# Altium schematic sheet DI 24v DC.SchDoc
size A4
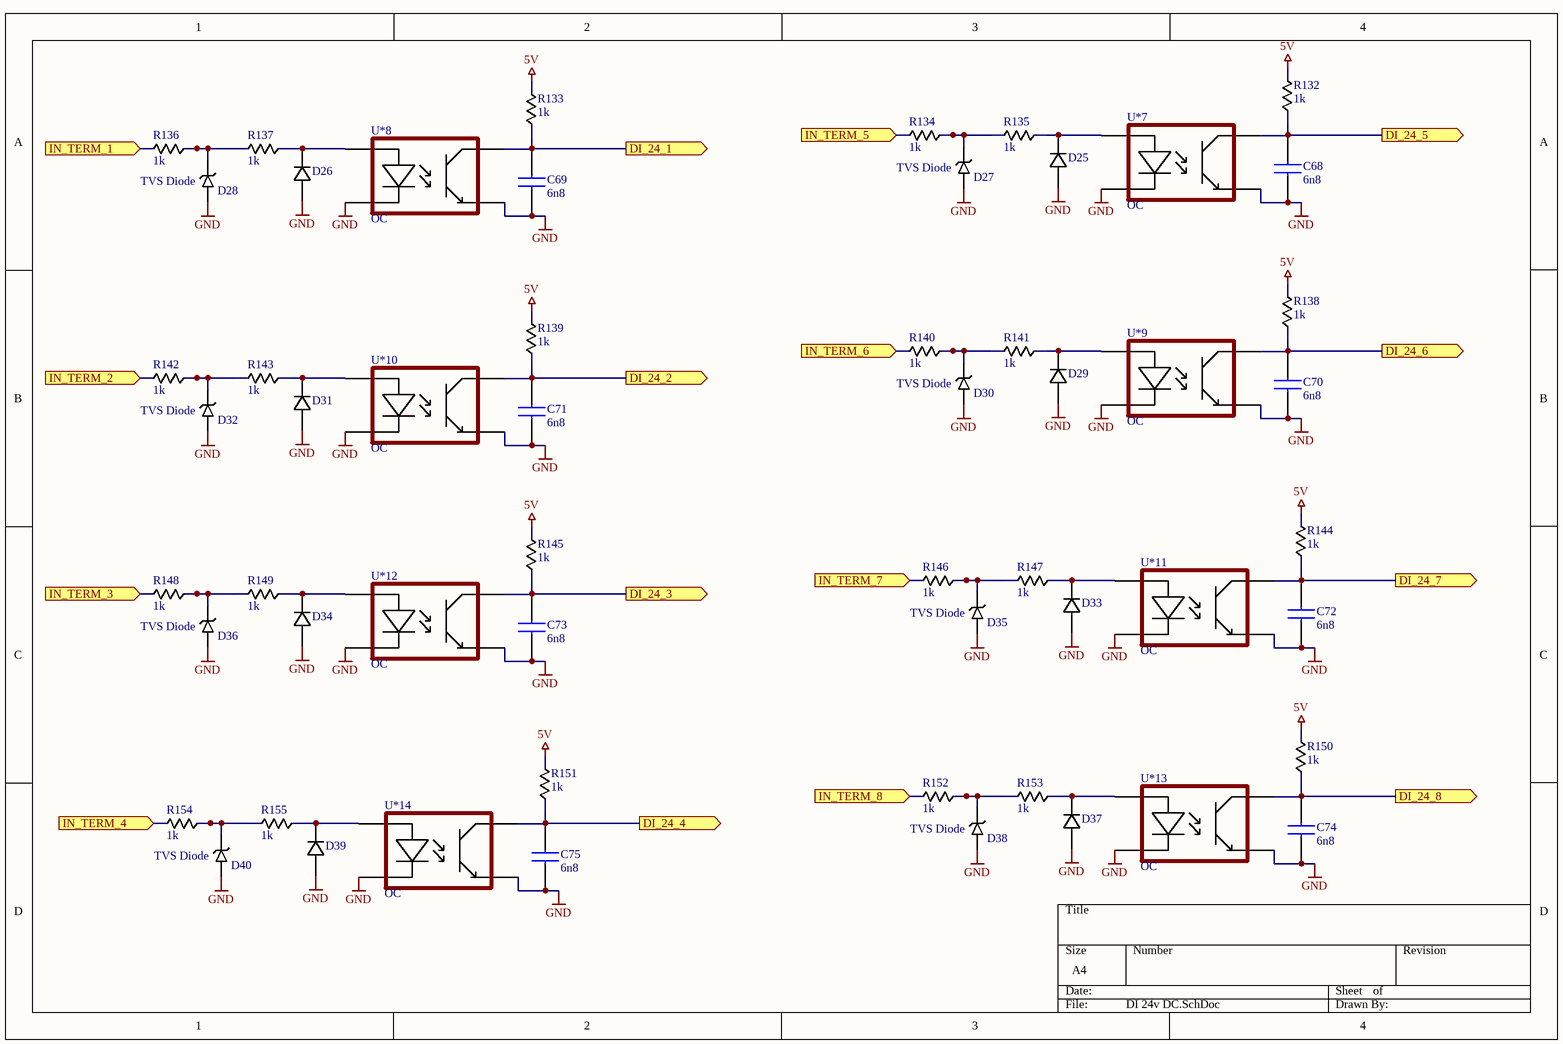
[diagram p0: DI 24v DC.SchDoc]

## Parts
C68  6n8  [0603 CAP]
C69  6n8  [0603 CAP]
C70  6n8  [0603 CAP]
C71  6n8  [0603 CAP]
C72  6n8  [0603 CAP]
C73  6n8  [0603 CAP]
C74  6n8  [0603 CAP]
C75  6n8  [0603 CAP]
D25  Diode_1  [SOD-323 (SC-76) - Reflow]  (value not drawn)
D26  Diode_1  [SOD-323 (SC-76) - Reflow]  (value not drawn)
D27  TVS Diode  [DO-214AC / SMA - POL]
D28  TVS Diode  [DO-214AC / SMA - POL]
D29  Diode_1  [SOD-323 (SC-76) - Reflow]  (value not drawn)
D30  TVS Diode  [DO-214AC / SMA - POL]
D31  Diode_1  [SOD-323 (SC-76) - Reflow]  (value not drawn)
D32  TVS Diode  [DO-214AC / SMA - POL]
D33  Diode_1  [SOD-323 (SC-76) - Reflow]  (value not drawn)
D34  Diode_1  [SOD-323 (SC-76) - Reflow]  (value not drawn)
D35  TVS Diode  [DO-214AC / SMA - POL]
D36  TVS Diode  [DO-214AC / SMA - POL]
D37  Diode_1  [SOD-323 (SC-76) - Reflow]  (value not drawn)
D38  TVS Diode  [DO-214AC / SMA - POL]
D39  Diode_1  [SOD-323 (SC-76) - Reflow]  (value not drawn)
D40  TVS Diode  [DO-214AC / SMA - POL]
R132  1k  [0603 CAP]
R133  1k  [0603 CAP]
R134  1k  [0603 CAP]
R135  1k  [0603 CAP]
R136  1k  [0603 CAP]
R137  1k  [0603 CAP]
R138  1k  [0603 CAP]
R139  1k  [0603 CAP]
R140  1k  [0603 CAP]
R141  1k  [0603 CAP]
R142  1k  [0603 CAP]
R143  1k  [0603 CAP]
R144  1k  [0603 CAP]
R145  1k  [0603 CAP]
R146  1k  [0603 CAP]
R147  1k  [0603 CAP]
R148  1k  [0603 CAP]
R149  1k  [0603 CAP]
R150  1k  [0603 CAP]
R151  1k  [0603 CAP]
R152  1k  [0603 CAP]
R153  1k  [0603 CAP]
R154  1k  [0603 CAP]
R155  1k  [0603 CAP]
U*7  OC  [LTV-357T]
U*8  OC  [LTV-357T]
U*9  OC  [LTV-357T]
U*10  OC  [LTV-357T]
U*11  OC  [LTV-357T]
U*12  OC  [LTV-357T]
U*13  OC  [LTV-357T]
U*14  OC  [LTV-357T]

## Ports
DI_24_1, DI_24_2, DI_24_3, DI_24_4, DI_24_5, DI_24_6, DI_24_7, DI_24_8, IN_TERM_1, IN_TERM_2, IN_TERM_3, IN_TERM_4, IN_TERM_5, IN_TERM_6, IN_TERM_7, IN_TERM_8

## Nets
5V: R132.2 R133.2 R138.2 R139.2 R144.2 R145.2 R150.2 R151.2
GND: C68.1 C69.1 C70.1 C71.1 C72.1 C73.1 C74.1 C75.1 D25.2(A) D26.2(A) D27.1 D28.1 D29.2(A) D30.1 D31.2(A) D32.1 D33.2(A) D34.2(A) D35.1 D36.1 D37.2(A) D38.1 D39.2(A) D40.1 U*7.Cathode(C) U*7.Emmiter(E) U*8.Cathode(C) U*8.Emmiter(E) U*9.Cathode(C) U*9.Emmiter(E) U*10.Cathode(C) U*10.Emmiter(E) U*11.Cathode(C) U*11.Emmiter(E) U*12.Cathode(C) U*12.Emmiter(E) U*13.Cathode(C) U*13.Emmiter(E) U*14.Cathode(C) U*14.Emmiter(E)
DI_24_1: C69.2 R133.1 U*8.Collector(C) ; port DI_24_1
DI_24_2: C71.2 R139.1 U*10.Collector(C) ; port DI_24_2
DI_24_3: C73.2 R145.1 U*12.Collector(C) ; port DI_24_3
DI_24_4: C75.2 R151.1 U*14.Collector(C) ; port DI_24_4
DI_24_5: C68.2 R132.1 U*7.Collector(C) ; port DI_24_5
DI_24_6: C70.2 R138.1 U*9.Collector(C) ; port DI_24_6
DI_24_7: C72.2 R144.1 U*11.Collector(C) ; port DI_24_7
DI_24_8: C74.2 R150.1 U*13.Collector(C) ; port DI_24_8
IN_TERM_1: R136.2 ; port IN_TERM_1
IN_TERM_2: R142.2 ; port IN_TERM_2
IN_TERM_3: R148.2 ; port IN_TERM_3
IN_TERM_4: R154.2 ; port IN_TERM_4
IN_TERM_5: R134.2 ; port IN_TERM_5
IN_TERM_6: R140.2 ; port IN_TERM_6
IN_TERM_7: R146.2 ; port IN_TERM_7
IN_TERM_8: R152.2 ; port IN_TERM_8
NetD25_1: D25.1(C) R135.1 U*7.Anode(A)
NetD26_1: D26.1(C) R137.1 U*8.Anode(A)
NetD27_2: D27.2 R134.1 R135.2
NetD28_2: D28.2 R136.1 R137.2
NetD29_1: D29.1(C) R141.1 U*9.Anode(A)
NetD30_2: D30.2 R140.1 R141.2
NetD31_1: D31.1(C) R143.1 U*10.Anode(A)
NetD32_2: D32.2 R142.1 R143.2
NetD33_1: D33.1(C) R147.1 U*11.Anode(A)
NetD34_1: D34.1(C) R149.1 U*12.Anode(A)
NetD35_2: D35.2 R146.1 R147.2
NetD36_2: D36.2 R148.1 R149.2
NetD37_1: D37.1(C) R153.1 U*13.Anode(A)
NetD38_2: D38.2 R152.1 R153.2
NetD39_1: D39.1(C) R155.1 U*14.Anode(A)
NetD40_2: D40.2 R154.1 R155.2

## Library data of the parts
C68-C75 = 0603 CAP: GRM188R71H682MA01D; Manufacturer_Name: Murata Electronics; Manufacturer_Part_Number: GRM188R72A103KA01D; Datasheet Link: https://search.murata.co.jp/Ceramy/image/img/A01X/G101/ENG/GRM188R72A103KA01-01A.pdf; Height: 0.9mm; Mouser Part Number: 81-GRM188R72A103KA1D; Mouser Price/Stock: https://www.mouser.co.uk/ProductDetail/Murata-Electronics/GRM188R72A103KA01D?qs=krk%2F6UQjCzAtl9phuocbug%3D%3D; Arrow Part Number: GRM188R72A103KA01D; Arrow Price/Stock: https://www.arrow.com/en/products/grm188r72a103ka01d/murata-manufacturing?region=europe
D25 D26 D29 D31 D33 D34 D37 D39 = Diode_1: 1N4148WS
D27 D28 D30 D32 D35 D36 D38 D40 = TVS_1_Uni: TVS Protective Diode Uni
R132-R155 = 0603 RES
U*7-U*14 = LTV-357T: pin to pad: Anode>1 Cathode>2 Collector>4 Emmiter>3